# Altium project CAN Breakout.PrjPcb
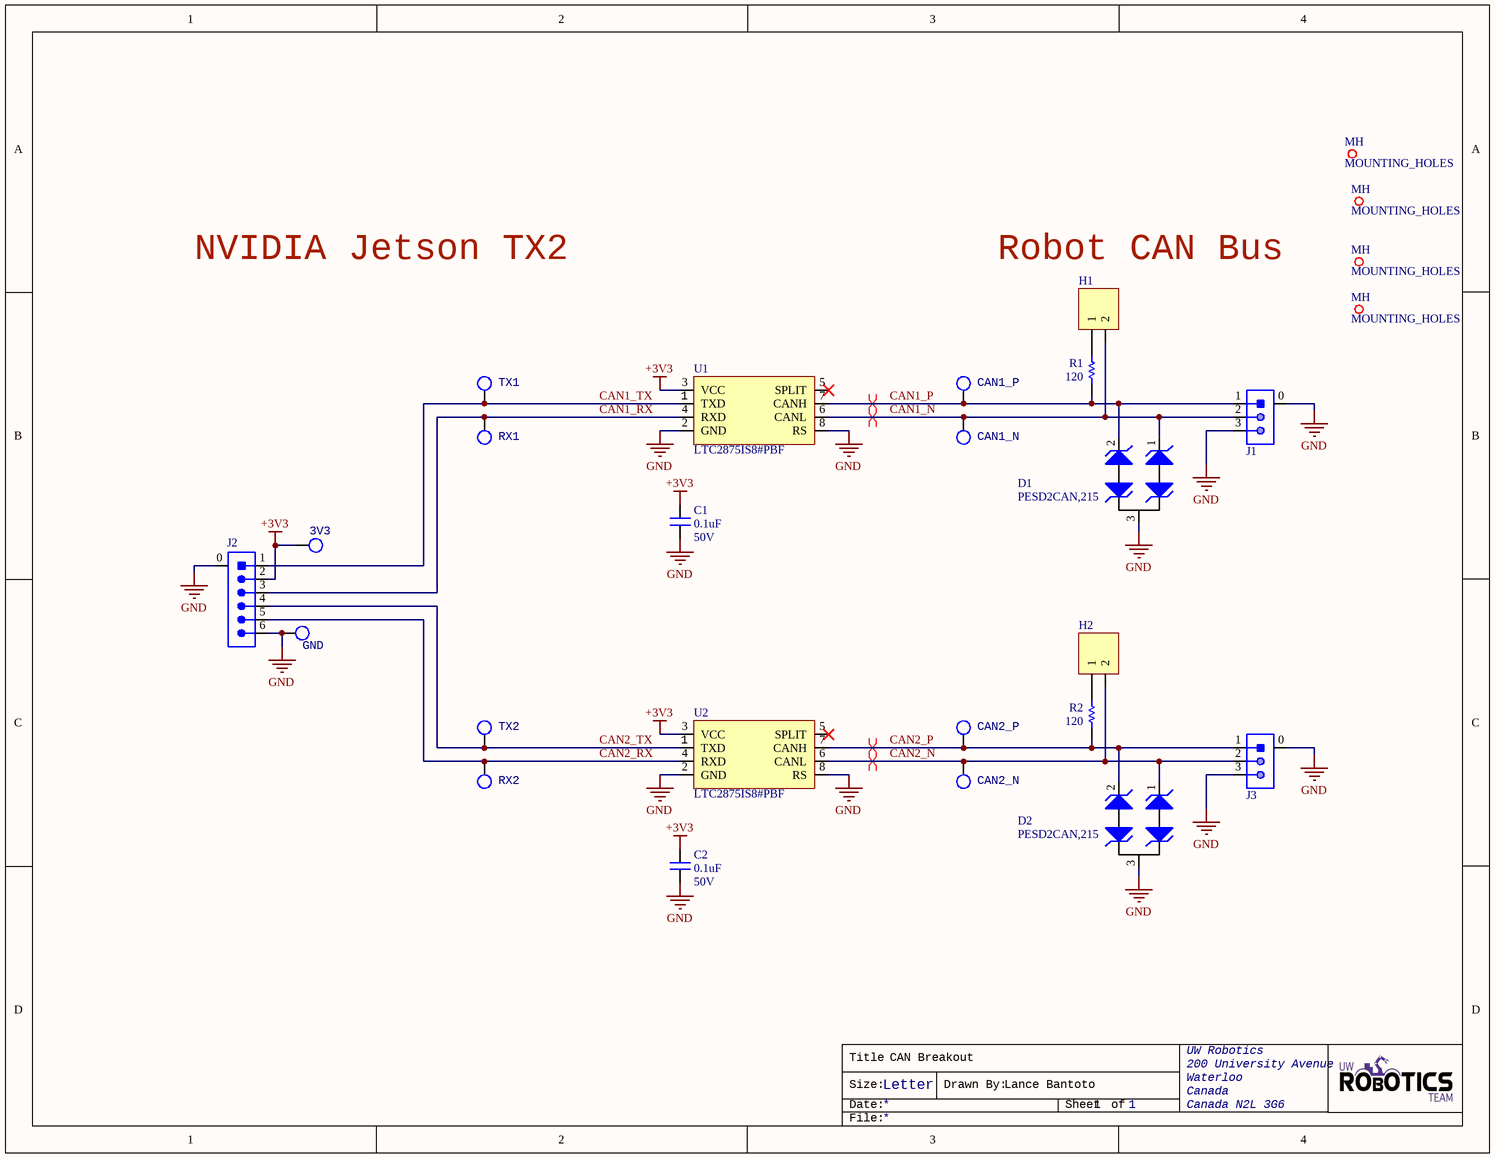
[diagram p0: CAN Breakout.SchDoc]
1 sheet, 27 parts. Net scope: global (net labels, ports and power ports of the same name join across sheets).
Board file: CAN Breakout.PcbDoc

## Sheet CAN Breakout.SchDoc: CAN Breakout
size Letter; DrawnBy: Lance Bantoto; Organization: UW Robotics; Address1: 200 University Avenue; Address2: Waterloo; Address3: Canada; Address4: Canada N2L 3G6; Revision: 1; SheetNumber: 1; SheetTotal: 1

### Parts
(Parts that share a designator on the sheet are numbered #1, #2 ... from top to bottom, then left to right.)
3V3  TESTPOINT_LOOP  [TESTPOINT_LOOP]  (value not drawn)
C1  value 0.1uF  Voltage Rating: 50V  [CAPC2012X140N]  (hidden comment: CAP_0.1uF_50V_0805)
C2  value 0.1uF  Voltage Rating: 50V  [CAPC2012X140N]  (hidden comment: CAP_0.1uF_50V_0805)
CAN1_N  TESTPOINT_LOOP  [TESTPOINT_LOOP]  (value not drawn)
CAN1_P  TESTPOINT_LOOP  [TESTPOINT_LOOP]  (value not drawn)
CAN2_N  TESTPOINT_LOOP  [TESTPOINT_LOOP]  (value not drawn)
CAN2_P  TESTPOINT_LOOP  [TESTPOINT_LOOP]  (value not drawn)
D1  Manufacturer Part Number 1: PESD2CAN,215  [TVS_DIODE_CAN]  (hidden comment: TVS_DIODE_CAN)
D2  Manufacturer Part Number 1: PESD2CAN,215  [TVS_DIODE_CAN]  (hidden comment: TVS_DIODE_CAN)
GND  TESTPOINT_LOOP  [TESTPOINT_LOOP]  (value not drawn)
H1  JUMPER_2  [HDR1X2]  (value not drawn)
H2  JUMPER_2  [HDR1X2]  (value not drawn)
J1  CON_3M_SM4  [JST-B3B-SM4-TB]  (value not drawn)
J2  CON_6M_SM4  [JST-B6B-SM4-TB]  (value not drawn)
J3  CON_3M_SM4  [JST-B3B-SM4-TB]  (value not drawn)
MH#1  MOUNTING_HOLES  [MOUNTING_HOLE]
MH#2  MOUNTING_HOLES  [MOUNTING_HOLE]
MH#3  MOUNTING_HOLES  [MOUNTING_HOLE]
MH#4  MOUNTING_HOLES  [MOUNTING_HOLE]
R1  120  [RESC2012X60N]
R2  120  [RESC2012X60N]
RX1  TESTPOINT_LOOP  [TESTPOINT_LOOP]  (value not drawn)
RX2  TESTPOINT_LOOP  [TESTPOINT_LOOP]  (value not drawn)
TX1  TESTPOINT_LOOP  [TESTPOINT_LOOP]  (value not drawn)
TX2  TESTPOINT_LOOP  [TESTPOINT_LOOP]  (value not drawn)
U1  Manufacturer Part Number 1: LTC2875IS8#PBF  [LT-S8_N]  (hidden comment: IC TXRX CAN)
U2  Manufacturer Part Number 1: LTC2875IS8#PBF  [LT-S8_N]  (hidden comment: IC TXRX CAN)

### Nets
+3V3: 3V3.1 C1.2 C2.2 J2.2 U1.3(VCC) U2.3(VCC)
GND: C1.1 C2.1 D1.3 D2.3 GND.1 J1.0 J1.3 J2.0 J2.6 J3.0 J3.3 U1.2(GND) U1.8(RS) U2.2(GND) U2.8(RS)
CAN1_N: CAN1_N.1 D1.1 H1.2 J1.2 U1.6(CANL)
CAN1_P: CAN1_P.1 D1.2 J1.1 R1.1 U1.7(CANH)
CAN1_RX: J2.3 RX1.1 U1.4(RXD)
CAN1_TX: J2.1 TX1.1 U1.1(TXD)
CAN2_N: CAN2_N.1 D2.1 H2.2 J3.2 U2.6(CANL)
CAN2_P: CAN2_P.1 D2.2 J3.1 R2.1 U2.7(CANH)
CAN2_RX: J2.5 RX2.1 U2.4(RXD)
CAN2_TX: J2.4 TX2.1 U2.1(TXD)
NetH1_1: H1.1 R1.2
NetH2_1: H2.1 R2.2

Not connected (* = marked no-connect by the designer): U1 5(SPLIT)*; U2 5(SPLIT)*

### Layout directives
differential pair: CAN1_N, CAN1_P, CAN2_N, CAN2_P

### Notes on the sheet
- NVIDIA Jetson TX2
- Robot CAN Bus
- Title
- Size:
- Date:
- Letter
- Drawn By:
- Sheet
- of
- File:

### Library data of the parts
3V3 CAN1_N CAN1_P CAN2_N CAN2_P GND RX1 RX2 TX1 TX2 = TESTPOINT_LOOP: Loop testpoint through-hole pad; Manufacturer Part Number 1: 5002; Manufacturer 1: Keystone Electronics; Supplier Part Number 1: 36-5002-ND; Supplier 1: Digi-Key; Mount: Through Hole
C1 C2 = CAP_0.1uF_50V_0805: CAP CER 0.1UF 50V X7R 0805; Manufacturer Part Number 1: GCD21BR71H104KA01L; Manufacturer 1: Murata; Capacitance: 100nF; Tolerance: 10%; Supplier Part Number 1: 490-11955-1-ND; Supplier 1: Digi-Key; Mount: Surface Mount; Case/Package: 0805; Case Code (Metric): 2012; Case Code (Imperial): 0805; Min Operating Temperature: -55°C; Max Operating Temperature: 125°C; Dielectric: X7R; Termination: SMD/SMT; Length: 2mm; Height: 1.25mm; Width: 0.049inch; Thickness: 0.049inch; Depth: 1.25mm; Ratings: AEC-Q200; ComponentLink1URL: https://datasheet.ciiva.com/29537/c03e-29537701.pdf?src-supplier=Digi-Key; ComponentLink1Description: https://datasheet.ciiva.com/29537/c03e-29537701.pdf?src-supplier=Digi-Key
D1 D2 = TVS_DIODE_CAN: TVS DIODE 24V 41V SOT323-3; Manufacturer 1: Nexperia USA Inc.; Package: SC-70, SOT-323; ComponentLink1Description: Datasheet; ComponentLink1URL: https://assets.nexperia.com/documents/data-sheet/PESD1CAN-U.pdf; Supplier Part Number 1: 1727-3891-1-ND; Supplier 1: Digi-Key; Mount: Surface Mount
H1 H2 = JUMPER_2: HEADER 2X1; Manufacturer 1: TE Connectivity; Manufacturer Part Number 1: 87220-2; Supplier 1: Digi-Key; Supplier Part Number 1: A26542-ND; Mount: Through Hole
J1 J3 = CON_3M_SM4: CONN HEADER SMD 3POS 2MM; Manufacturer 1: JST; Manufacturer Part Number 1: B3B-PH-SM4-TB(LF)(SN); Max Current Rating: 2A; Max Voltage Rating: 100V; Supplier 1: Digi-Key; Supplier Part Number 1: 455-1735-1-ND; ComponentLink1URL: https://datasheet.ciiva.com/11747/0900766b80ddea81-11747684.pdf?src-supplier=RSComponents; ComponentLink1Description: https://datasheet.ciiva.com/11747/0900766b80ddea81-11747684.pdf?src-supplier=RSComponents; Pitch: 2mm; Mount: Surface Mount
J2 = CON_6M_SM4: CONN HEADER SMD 6POS 2MM; Manufacturer Part Number: B6B-PH-SM4-TB(LF)(SN); Manufacturer: JST; Current Rating: 2A; Voltage Rating: 100V; Mount: Surface Mount; Supplier 1: DigiKey; Supplier Part Number 1: 455-1738-1-ND
MH#1-MH#4 = MOUNTING_HOLES: 6cm x 6cm
R1 R2 = RES_120R_0805: RES SMD 120 OHM 1% 1/8W 0805; Manufacturer 1: Vishay; Manufacturer Part Number 1: CRCW0805120RFKEA; Power Rating: 125mW; Voltage Rating: 150V; Supplier Part Number 1: 541-120CCT-ND; Supplier 1: Digi-Key; Mount: Surface Mount; ComponentLink1URL: https://datasheet.ciiva.com/11810/0900766b80d98b26-11810477.pdf?src-supplier=RSComponents; ComponentLink1Description: https://datasheet.ciiva.com/11810/0900766b80d98b26-11810477.pdf?src-supplier=RSComponents; ComponentLink2URL: https://datasheet.ciiva.com/3258/dcrcwe3-3258069.pdf?src-supplier=Avnet; ComponentLink2Description: https://datasheet.ciiva.com/3258/dcrcwe3-3258069.pdf?src-supplier=Avnet; ComponentLink3URL: https://datasheet.ciiva.com/26317/fld-crcw-e3-data-en-26317334.pdf?src-supplier=Distrelec; ComponentLink3Description: https://datasheet.ciiva.com/26317/fld-crcw-e3-data-en-26317334.pdf?src-supplier=Distrelec; ComponentLink4URL: https://datasheet.ciiva.com/2467/dcrcwe3-2467512.pdf?src-supplier=Digi-Key; ComponentLink4Description: https://datasheet.ciiva.com/2467/dcrcwe3-2467512.pdf?src-supplier=Digi-Key; ComponentLink5URL: https://datasheet.ciiva.com/2467/dcrcwe3-2467514.pdf?src-supplier=Digi-Key; ComponentLink5Description: https://datasheet.ciiva.com/2467/dcrcwe3-2467514.pdf?src-supplier=Digi-Key; ComponentLink6URL: https://datasheet.ciiva.com/16211/dcrcwe3-16211931.pdf?src-supplier=Future+Electronics; ComponentLink6Description: https://datasheet.ciiva.com/16211/dcrcwe3-16211931.pdf?src-supplier=Future+Electronics; ComponentLink7URL: https://datasheet.ciiva.com/2467/dcrcwe3-2467513.pdf?src-supplier=Digi-Key; ComponentLink7Description: https://datasheet.ciiva.com/2467/dcrcwe3-2467513.pdf?src-supplier=Digi-Key; ComponentLink8URL: https://datasheet.ciiva.com/16852/dcrcwe3-16852841.pdf?src-supplier=Avnet+Europe; ComponentLink8Description: https://datasheet.ciiva.com/16852/dcrcwe3-16852841.pdf?src-supplier=Avnet+Europe; ComponentLink9URL: https://datasheet.ciiva.com/7777/1697337-7777354.pdf?src-supplier=Element14; ComponentLink9Description: https://datasheet.ciiva.com/7777/1697337-7777354.pdf?src-supplier=Element14; ComponentLink10URL: https://datasheet.ciiva.com/16788/70201119-16788154.pdf?src-supplier=Allied+Electronics; ComponentLink10Description: https://datasheet.ciiva.com/16788/70201119-16788154.pdf?src-supplier=Allied+Electronics; ComponentLink11URL: https://datasheet.ciiva.com/7777/1720486-7777567.pdf?src-supplier=Element14; ComponentLink11Description: https://datasheet.ciiva.com/7777/1720486-7777567.pdf?src-supplier=Element14; Case Code (Imperial): 0805; Case Code (Metric): 2012; Resistance: 120
U1 U2 = LTC2875: IC TXRX CAN 4MBPS 8SO; Manufacturer 1: Linear Technologies; Package: 8-SOIC (0.154", 3.90mm Width); ComponentLink1Description: Datasheet; ComponentLink1URL: https://www.analog.com/media/en/technical-documentation/data-sheets/2875f.pdf; Supplier Part Number 1: LTC2875IS8#PBF-ND; Supplier 1: Digi-Key; Mount: Surface Mount